# EAGLE schematic 56 ch sample-and-hold card v1.0 (EAGLE 9.6.2)

## Sheet 1 of 3
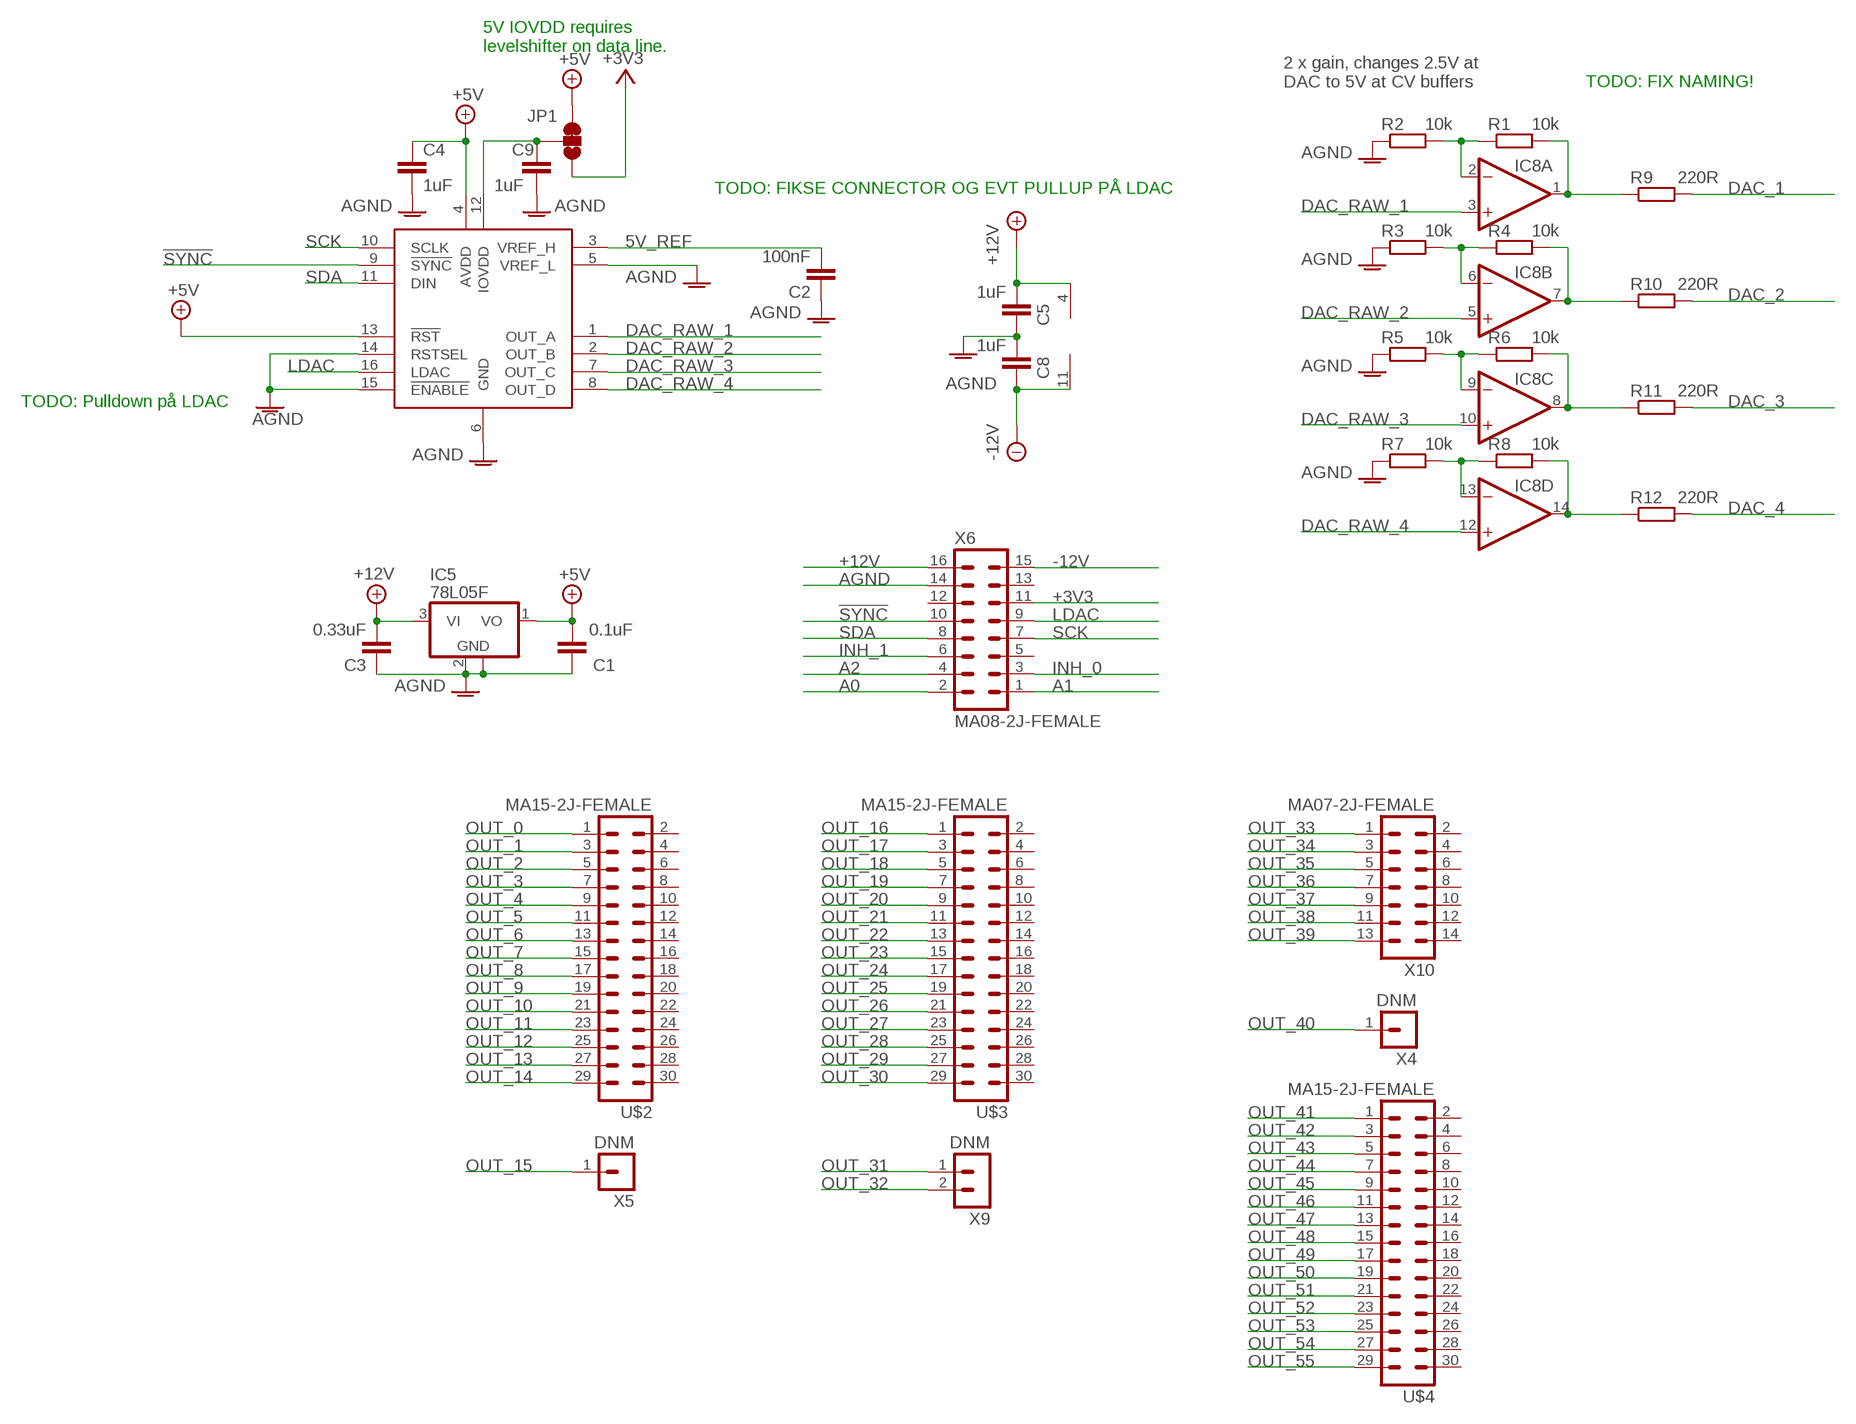
[diagram p0: schematic, sheet 1]

### Parts
C1  0.1uF  C-EUC0603  [C0603]
C2  100nF  C-EUC0603  [C0603]
C3  0.33uF  C-EUC0603  [C0603]
C4  1uF  C-EU-J0402  [C0402-J]
C5  1uF  C-EU-J0402  [C0402-J]
C8  1uF  C-EU-J0402  [C0402-J]
C9  1uF  C-EU-J0402  [C0402-J]
IC2  DAC8565F  [DIL16-FM-CON]
IC5  78L05F  [SOT89]
IC8  TL074JT  [TSSOP14J]
JP1  JUMPER-SMT_3_1-NC_TRACE_NO-SILK_DNM  JUMPER-SMT_3_1-NC_TRACE_NO-SILK  [SMT-JUMPER_3_1-NC_TRACE_NO-SILK]
R1  10k  R-EU_R0603  [R0603]
R2  10k  R-EU_R0603  [R0603]
R3  10k  R-EU_R0603  [R0603]
R4  10k  R-EU_R0603  [R0603]
R5  10k  R-EU_R0603  [R0603]
R6  10k  R-EU_R0603  [R0603]
R7  10k  R-EU_R0603  [R0603]
R8  10k  R-EU_R0603  [R0603]
R9  220R  R-EU_R0603  [R0603]
R10  220R  R-EU_R0603  [R0603]
R11  220R  R-EU_R0603  [R0603]
R12  220R  R-EU_R0603  [R0603]
U$2  MA15-2J-FEMALE  MA15-2J  [MA15-2J]
U$3  MA15-2J-FEMALE  MA15-2J  [MA15-2J]
U$4  MA15-2J-FEMALE  MA15-2J  [MA15-2J]
X4  DNM  MA01-1JN  [MA01N-1J]
X5  DNM  MA01-1JN  [MA01N-1J]
X6  MA08-2J-FEMALE  MA08-2J  [MA08-2J]
X9  DNM  MA02-1JN  [MA02N-1J]
X10  MA07-2J-FEMALE  MA07-2J  [MA07-2J]

### Nets
5V_REF: C2.2 IC2.3(VREF_H)
!SYNC: IC2.9(!SYNC) X6.10
+3V3: JP1.1 X6.11
+5V: C1.2 C4.1 IC2.4(AVDD) IC2.13(!RST) IC5.1(VO) JP1.3 ; also sheet 2,3
+12V: C3.2 C5.1 IC5.3(VI) IC8.4(P:V+) X6.16 ; also sheet 2,3
-12V: C8.2 IC8.11(P:V-) X6.15 ; also sheet 2,3
A0: X6.2 ; also sheet 2,3
A1: X6.1 ; also sheet 2,3
A2: X6.4 ; also sheet 2,3
AGND: C1.1 C2.1 C3.1 C4.2 C5.2 C8.1 C9.2 IC2.5(VREF_L) IC2.6(GND) IC2.14(RSTSEL) IC2.15(!ENABLE) IC5.2(GND) IC5.2@1(GND) R2.1 R3.1 R5.1 R7.1 X6.14 ; also sheet 2,3
DAC_1: R9.2 ; also sheet 3
DAC_2: R10.2 ; also sheet 3
DAC_3: R11.2 ; also sheet 2
DAC_4: R12.2 ; also sheet 2
DAC_BUF_1: IC8.1(A:OUT) R1.2 R9.1
DAC_BUF_2: IC8.7(B:OUT) R4.2 R10.1
DAC_BUF_3: IC8.8(C:OUT) R6.2 R11.1
DAC_BUF_4: IC8.14(D:OUT) R8.2 R12.1
DAC_RAW_1: IC2.1(OUT_A) IC8.3(A:+IN)
DAC_RAW_2: IC2.2(OUT_B) IC8.5(B:+IN)
DAC_RAW_3: IC2.7(OUT_C) IC8.10(C:+IN)
DAC_RAW_4: IC2.8(OUT_D) IC8.12(D:+IN)
INH_0: X6.3 ; also sheet 2,3
INH_1: X6.6 ; also sheet 2,3
LDAC: IC2.16(LDAC) X6.9
N$1: C9.1 IC2.12(IOVDD) JP1.2
N$2: IC8.2(A:-IN) R1.1 R2.2
N$3: IC8.6(B:-IN) R3.2 R4.1
N$4: IC8.9(C:-IN) R5.2 R6.1
N$5: IC8.13(D:-IN) R7.2 R8.1
OUT_0: U$2.1 ; also sheet 2
OUT_1: U$2.3 ; also sheet 2
OUT_2: U$2.5 ; also sheet 2
OUT_3: U$2.7 ; also sheet 2
OUT_4: U$2.9 ; also sheet 2
OUT_5: U$2.11 ; also sheet 2
OUT_6: U$2.13 ; also sheet 2
OUT_7: U$2.15 ; also sheet 2
OUT_8: U$2.17 ; also sheet 2
OUT_9: U$2.19 ; also sheet 2
OUT_10: U$2.21 ; also sheet 2
OUT_11: U$2.23 ; also sheet 2
OUT_12: U$2.25 ; also sheet 2
OUT_13: U$2.27 ; also sheet 2
OUT_14: U$2.29 ; also sheet 2
OUT_15: X5.1 ; also sheet 2
OUT_16: U$3.1 ; also sheet 2
OUT_17: U$3.3 ; also sheet 2
OUT_18: U$3.5 ; also sheet 2
OUT_19: U$3.7 ; also sheet 2
OUT_20: U$3.9 ; also sheet 2
OUT_21: U$3.11 ; also sheet 2
OUT_22: U$3.13 ; also sheet 2
OUT_23: U$3.15 ; also sheet 2
OUT_24: U$3.17 ; also sheet 2
OUT_25: U$3.19 ; also sheet 2
OUT_26: U$3.21 ; also sheet 2
OUT_27: U$3.23 ; also sheet 2
OUT_28: U$3.25 ; also sheet 2
OUT_29: U$3.27 ; also sheet 2
OUT_30: U$3.29 ; also sheet 2
OUT_31: X9.1 ; also sheet 2
OUT_32: X9.2 ; also sheet 3
OUT_33: X10.1 ; also sheet 3
OUT_34: X10.3 ; also sheet 3
OUT_35: X10.5 ; also sheet 3
OUT_36: X10.7 ; also sheet 3
OUT_37: X10.9 ; also sheet 3
OUT_38: X10.11 ; also sheet 3
OUT_39: X10.13 ; also sheet 3
OUT_40: X4.1 ; also sheet 3
OUT_41: U$4.1 ; also sheet 3
OUT_42: U$4.3 ; also sheet 3
OUT_43: U$4.5 ; also sheet 3
OUT_44: U$4.7 ; also sheet 3
OUT_45: U$4.9 ; also sheet 3
OUT_46: U$4.11 ; also sheet 3
OUT_47: U$4.13 ; also sheet 3
OUT_48: U$4.15 ; also sheet 3
OUT_49: U$4.17 ; also sheet 3
OUT_50: U$4.19 ; also sheet 3
OUT_51: U$4.21 ; also sheet 3
OUT_52: U$4.23 ; also sheet 3
OUT_53: U$4.25 ; also sheet 3
OUT_54: U$4.27 ; also sheet 3
OUT_55: U$4.29 ; also sheet 3
SCK: IC2.10(SCLK) X6.7
SDA: IC2.11(DIN) X6.8
Unconnected: U$2.2 U$2.4 U$2.6 U$2.8 U$2.10 U$2.12 U$2.14 U$2.16 U$2.18 U$2.20 U$2.22 U$2.24 U$2.26 U$2.28 U$2.30 U$3.2 U$3.4 U$3.6 U$3.8 U$3.10 U$3.12 U$3.14 U$3.16 U$3.18 U$3.20 U$3.22 U$3.24 U$3.26 U$3.28 U$3.30 U$4.2 U$4.4 U$4.6 U$4.8 U$4.10 U$4.12 U$4.14 U$4.16 U$4.18 U$4.20 U$4.22 U$4.24 U$4.26 U$4.28 U$4.30 X6.5 X6.12 X6.13 X10.2 X10.4 X10.6 X10.8 X10.10 X10.12 X10.14

### Notes on the sheet
- 5V IOVDD requires
  levelshifter on data line.
- 2 x gain, changes 2.5V at
  DAC to 5V at CV buffers
- TODO: FIX NAMING!
- TODO: FIKSE CONNECTOR OG EVT PULLUP PÅ LDAC
- TODO: Pulldown på LDAC

## Sheet 2 of 3
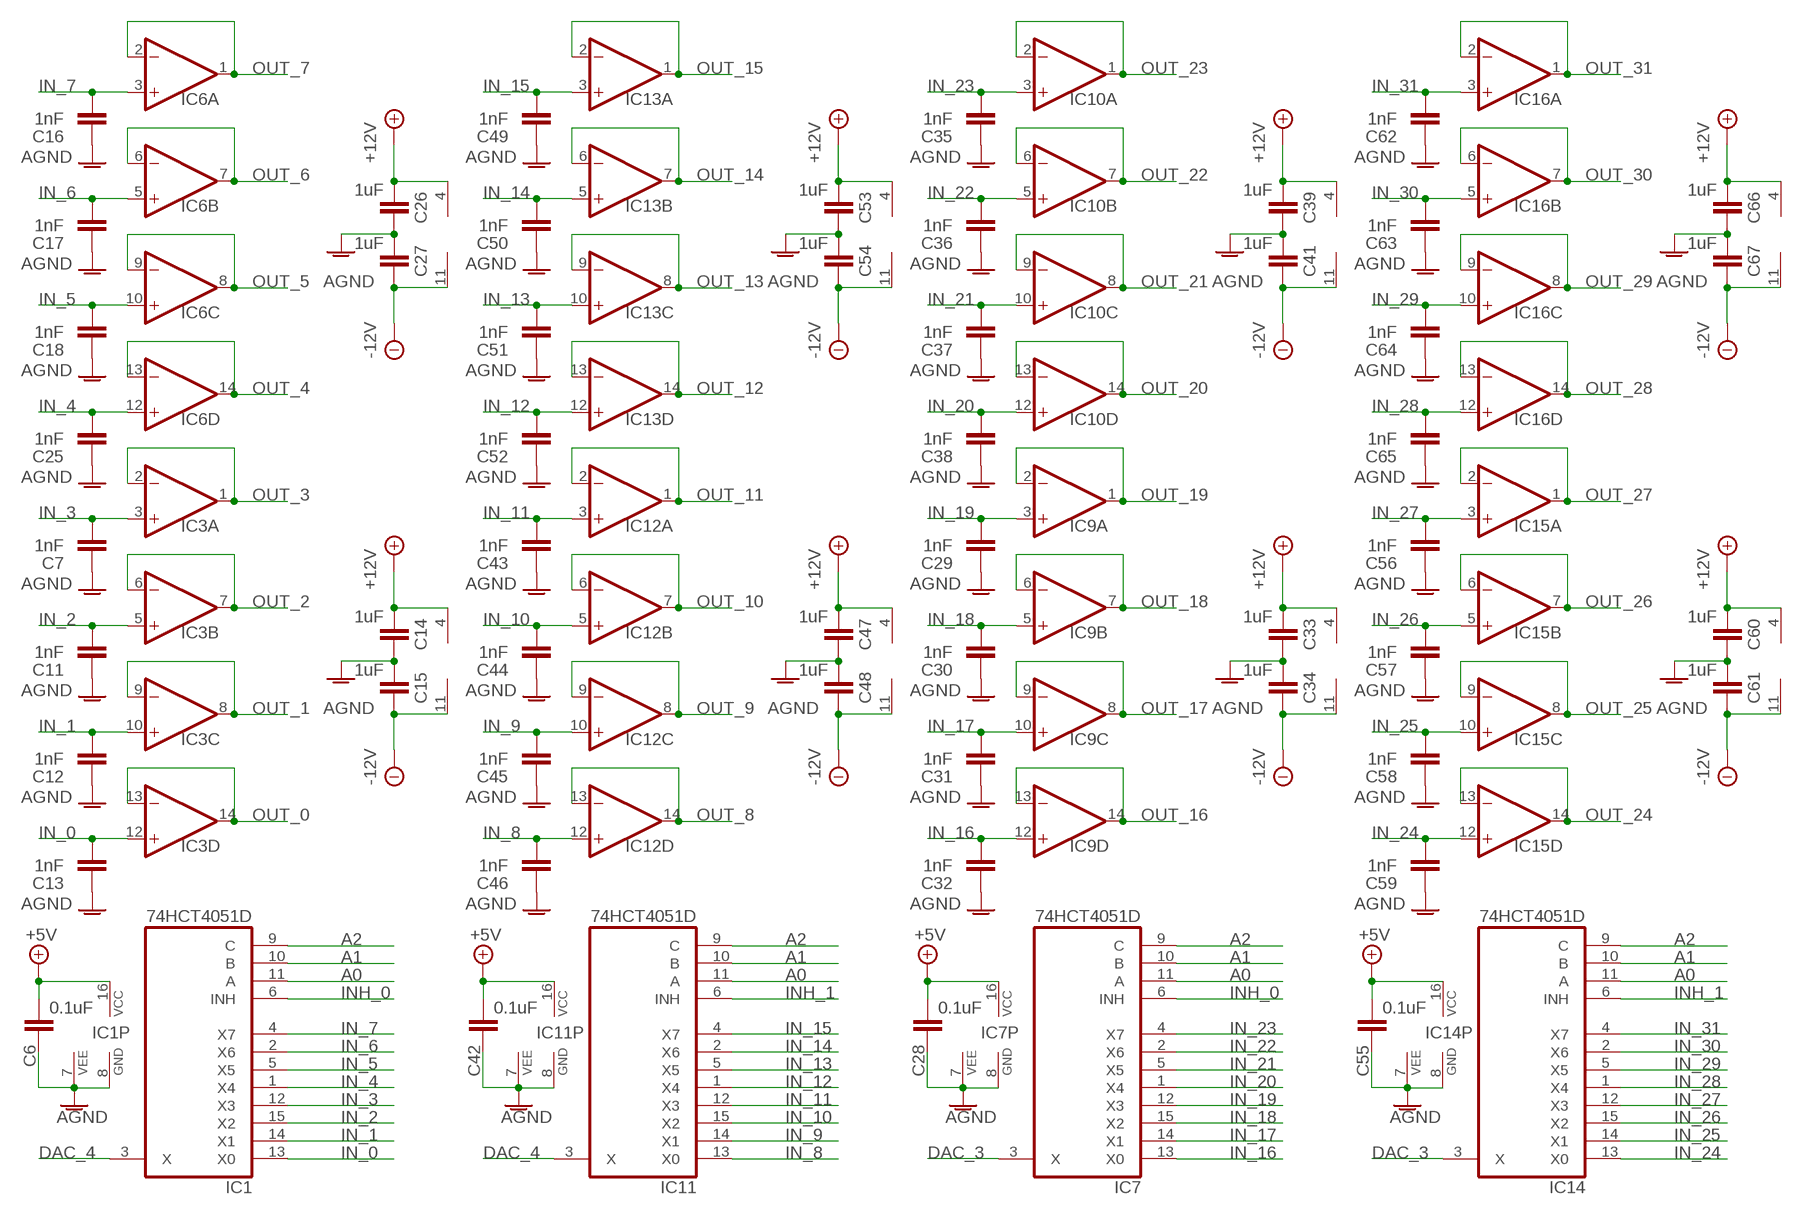
[diagram p1: schematic, sheet 2]

### Parts
C6  0.1uF  C-EU-J0402  [C0402-J]
C7  1nF  C-EU-J0603  [C0603-J]
C11  1nF  C-EU-J0603  [C0603-J]
C12  1nF  C-EU-J0603  [C0603-J]
C13  1nF  C-EU-J0603  [C0603-J]
C14  1uF  C-EU-J0402  [C0402-J]
C15  1uF  C-EU-J0402  [C0402-J]
C16  1nF  C-EU-J0603  [C0603-J]
C17  1nF  C-EU-J0603  [C0603-J]
C18  1nF  C-EU-J0603  [C0603-J]
C25  1nF  C-EU-J0603  [C0603-J]
C26  1uF  C-EU-J0402  [C0402-J]
C27  1uF  C-EU-J0402  [C0402-J]
C28  0.1uF  C-EU-J0402  [C0402-J]
C29  1nF  C-EU-J0603  [C0603-J]
C30  1nF  C-EU-J0603  [C0603-J]
C31  1nF  C-EU-J0603  [C0603-J]
C32  1nF  C-EU-J0603  [C0603-J]
C33  1uF  C-EU-J0402  [C0402-J]
C34  1uF  C-EU-J0402  [C0402-J]
C35  1nF  C-EU-J0603  [C0603-J]
C36  1nF  C-EU-J0603  [C0603-J]
C37  1nF  C-EU-J0603  [C0603-J]
C38  1nF  C-EU-J0603  [C0603-J]
C39  1uF  C-EU-J0402  [C0402-J]
C41  1uF  C-EU-J0402  [C0402-J]
C42  0.1uF  C-EU-J0402  [C0402-J]
C43  1nF  C-EU-J0603  [C0603-J]
C44  1nF  C-EU-J0603  [C0603-J]
C45  1nF  C-EU-J0603  [C0603-J]
C46  1nF  C-EU-J0603  [C0603-J]
C47  1uF  C-EU-J0402  [C0402-J]
C48  1uF  C-EU-J0402  [C0402-J]
C49  1nF  C-EU-J0603  [C0603-J]
C50  1nF  C-EU-J0603  [C0603-J]
C51  1nF  C-EU-J0603  [C0603-J]
C52  1nF  C-EU-J0603  [C0603-J]
C53  1uF  C-EU-J0402  [C0402-J]
C54  1uF  C-EU-J0402  [C0402-J]
C55  0.1uF  C-EU-J0402  [C0402-J]
C56  1nF  C-EU-J0603  [C0603-J]
C57  1nF  C-EU-J0603  [C0603-J]
C58  1nF  C-EU-J0603  [C0603-J]
C59  1nF  C-EU-J0603  [C0603-J]
C60  1uF  C-EU-J0402  [C0402-J]
C61  1uF  C-EU-J0402  [C0402-J]
C62  1nF  C-EU-J0603  [C0603-J]
C63  1nF  C-EU-J0603  [C0603-J]
C64  1nF  C-EU-J0603  [C0603-J]
C65  1nF  C-EU-J0603  [C0603-J]
C66  1uF  C-EU-J0402  [C0402-J]
C67  1uF  C-EU-J0402  [C0402-J]
IC1  74HCT4051D  4051D  [SO16]
IC3  TL074JT  [TSSOP14J]
IC6  TL074JT  [TSSOP14J]
IC7  74HCT4051D  4051D  [SO16]
IC9  TL074JT  [TSSOP14J]
IC10  TL074JT  [TSSOP14J]
IC11  74HCT4051D  4051D  [SO16]
IC12  TL074JT  [TSSOP14J]
IC13  TL074JT  [TSSOP14J]
IC14  74HCT4051D  4051D  [SO16]
IC15  TL074JT  [TSSOP14J]
IC16  TL074JT  [TSSOP14J]

### Nets
+5V: C6.2 C28.2 C42.2 C55.2 IC1.16(VCC) IC7.16(VCC) IC11.16(VCC) IC14.16(VCC) ; also sheet 1,3
+12V: C14.1 C26.1 C33.1 C39.1 C47.1 C53.1 C60.1 C66.1 IC3.4(P:V+) IC6.4(P:V+) IC9.4(P:V+) IC10.4(P:V+) IC12.4(P:V+) IC13.4(P:V+) IC15.4(P:V+) IC16.4(P:V+) ; also sheet 1,3
-12V: C15.2 C27.2 C34.2 C41.2 C48.2 C54.2 C61.2 C67.2 IC3.11(P:V-) IC6.11(P:V-) IC9.11(P:V-) IC10.11(P:V-) IC12.11(P:V-) IC13.11(P:V-) IC15.11(P:V-) IC16.11(P:V-) ; also sheet 1,3
A0: IC1.11(A) IC7.11(A) IC11.11(A) IC14.11(A) ; also sheet 1,3
A1: IC1.10(B) IC7.10(B) IC11.10(B) IC14.10(B) ; also sheet 1,3
A2: IC1.9(C) IC7.9(C) IC11.9(C) IC14.9(C) ; also sheet 1,3
AGND: C6.1 C7.1 C11.1 C12.1 C13.1 C14.2 C15.1 C16.1 C17.1 C18.1 C25.1 C26.2 C27.1 C28.1 C29.1 C30.1 C31.1 C32.1 C33.2 C34.1 C35.1 C36.1 C37.1 C38.1 C39.2 C41.1 C42.1 C43.1 C44.1 C45.1 C46.1 C47.2 C48.1 C49.1 C50.1 C51.1 C52.1 C53.2 C54.1 C55.1 C56.1 C57.1 C58.1 C59.1 C60.2 C61.1 C62.1 C63.1 C64.1 C65.1 C66.2 C67.1 IC1.7(VEE) IC1.8(GND) IC7.7(VEE) IC7.8(GND) IC11.7(VEE) IC11.8(GND) IC14.7(VEE) IC14.8(GND) ; also sheet 1,3
DAC_3: IC7.3(X) IC14.3(X) ; also sheet 1
DAC_4: IC1.3(X) IC11.3(X) ; also sheet 1
IN_0: C13.2 IC1.13(X0) IC3.12(D:+IN)
IN_1: C12.2 IC1.14(X1) IC3.10(C:+IN)
IN_2: C11.2 IC1.15(X2) IC3.5(B:+IN)
IN_3: C7.2 IC1.12(X3) IC3.3(A:+IN)
IN_4: C25.2 IC1.1(X4) IC6.12(D:+IN)
IN_5: C18.2 IC1.5(X5) IC6.10(C:+IN)
IN_6: C17.2 IC1.2(X6) IC6.5(B:+IN)
IN_7: C16.2 IC1.4(X7) IC6.3(A:+IN)
IN_8: C46.2 IC11.13(X0) IC12.12(D:+IN)
IN_9: C45.2 IC11.14(X1) IC12.10(C:+IN)
IN_10: C44.2 IC11.15(X2) IC12.5(B:+IN)
IN_11: C43.2 IC11.12(X3) IC12.3(A:+IN)
IN_12: C52.2 IC11.1(X4) IC13.12(D:+IN)
IN_13: C51.2 IC11.5(X5) IC13.10(C:+IN)
IN_14: C50.2 IC11.2(X6) IC13.5(B:+IN)
IN_15: C49.2 IC11.4(X7) IC13.3(A:+IN)
IN_16: C32.2 IC7.13(X0) IC9.12(D:+IN)
IN_17: C31.2 IC7.14(X1) IC9.10(C:+IN)
IN_18: C30.2 IC7.15(X2) IC9.5(B:+IN)
IN_19: C29.2 IC7.12(X3) IC9.3(A:+IN)
IN_20: C38.2 IC7.1(X4) IC10.12(D:+IN)
IN_21: C37.2 IC7.5(X5) IC10.10(C:+IN)
IN_22: C36.2 IC7.2(X6) IC10.5(B:+IN)
IN_23: C35.2 IC7.4(X7) IC10.3(A:+IN)
IN_24: C59.2 IC14.13(X0) IC15.12(D:+IN)
IN_25: C58.2 IC14.14(X1) IC15.10(C:+IN)
IN_26: C57.2 IC14.15(X2) IC15.5(B:+IN)
IN_27: C56.2 IC14.12(X3) IC15.3(A:+IN)
IN_28: C65.2 IC14.1(X4) IC16.12(D:+IN)
IN_29: C64.2 IC14.5(X5) IC16.10(C:+IN)
IN_30: C63.2 IC14.2(X6) IC16.5(B:+IN)
IN_31: C62.2 IC14.4(X7) IC16.3(A:+IN)
INH_0: IC1.6(INH) IC7.6(INH) ; also sheet 1,3
INH_1: IC11.6(INH) IC14.6(INH) ; also sheet 1,3
OUT_0: IC3.13(D:-IN) IC3.14(D:OUT) ; also sheet 1
OUT_1: IC3.8(C:OUT) IC3.9(C:-IN) ; also sheet 1
OUT_2: IC3.6(B:-IN) IC3.7(B:OUT) ; also sheet 1
OUT_3: IC3.1(A:OUT) IC3.2(A:-IN) ; also sheet 1
OUT_4: IC6.13(D:-IN) IC6.14(D:OUT) ; also sheet 1
OUT_5: IC6.8(C:OUT) IC6.9(C:-IN) ; also sheet 1
OUT_6: IC6.6(B:-IN) IC6.7(B:OUT) ; also sheet 1
OUT_7: IC6.1(A:OUT) IC6.2(A:-IN) ; also sheet 1
OUT_8: IC12.13(D:-IN) IC12.14(D:OUT) ; also sheet 1
OUT_9: IC12.8(C:OUT) IC12.9(C:-IN) ; also sheet 1
OUT_10: IC12.6(B:-IN) IC12.7(B:OUT) ; also sheet 1
OUT_11: IC12.1(A:OUT) IC12.2(A:-IN) ; also sheet 1
OUT_12: IC13.13(D:-IN) IC13.14(D:OUT) ; also sheet 1
OUT_13: IC13.8(C:OUT) IC13.9(C:-IN) ; also sheet 1
OUT_14: IC13.6(B:-IN) IC13.7(B:OUT) ; also sheet 1
OUT_15: IC13.1(A:OUT) IC13.2(A:-IN) ; also sheet 1
OUT_16: IC9.13(D:-IN) IC9.14(D:OUT) ; also sheet 1
OUT_17: IC9.8(C:OUT) IC9.9(C:-IN) ; also sheet 1
OUT_18: IC9.6(B:-IN) IC9.7(B:OUT) ; also sheet 1
OUT_19: IC9.1(A:OUT) IC9.2(A:-IN) ; also sheet 1
OUT_20: IC10.13(D:-IN) IC10.14(D:OUT) ; also sheet 1
OUT_21: IC10.8(C:OUT) IC10.9(C:-IN) ; also sheet 1
OUT_22: IC10.6(B:-IN) IC10.7(B:OUT) ; also sheet 1
OUT_23: IC10.1(A:OUT) IC10.2(A:-IN) ; also sheet 1
OUT_24: IC15.13(D:-IN) IC15.14(D:OUT) ; also sheet 1
OUT_25: IC15.8(C:OUT) IC15.9(C:-IN) ; also sheet 1
OUT_26: IC15.6(B:-IN) IC15.7(B:OUT) ; also sheet 1
OUT_27: IC15.1(A:OUT) IC15.2(A:-IN) ; also sheet 1
OUT_28: IC16.13(D:-IN) IC16.14(D:OUT) ; also sheet 1
OUT_29: IC16.8(C:OUT) IC16.9(C:-IN) ; also sheet 1
OUT_30: IC16.6(B:-IN) IC16.7(B:OUT) ; also sheet 1
OUT_31: IC16.1(A:OUT) IC16.2(A:-IN) ; also sheet 1

## Sheet 3 of 3
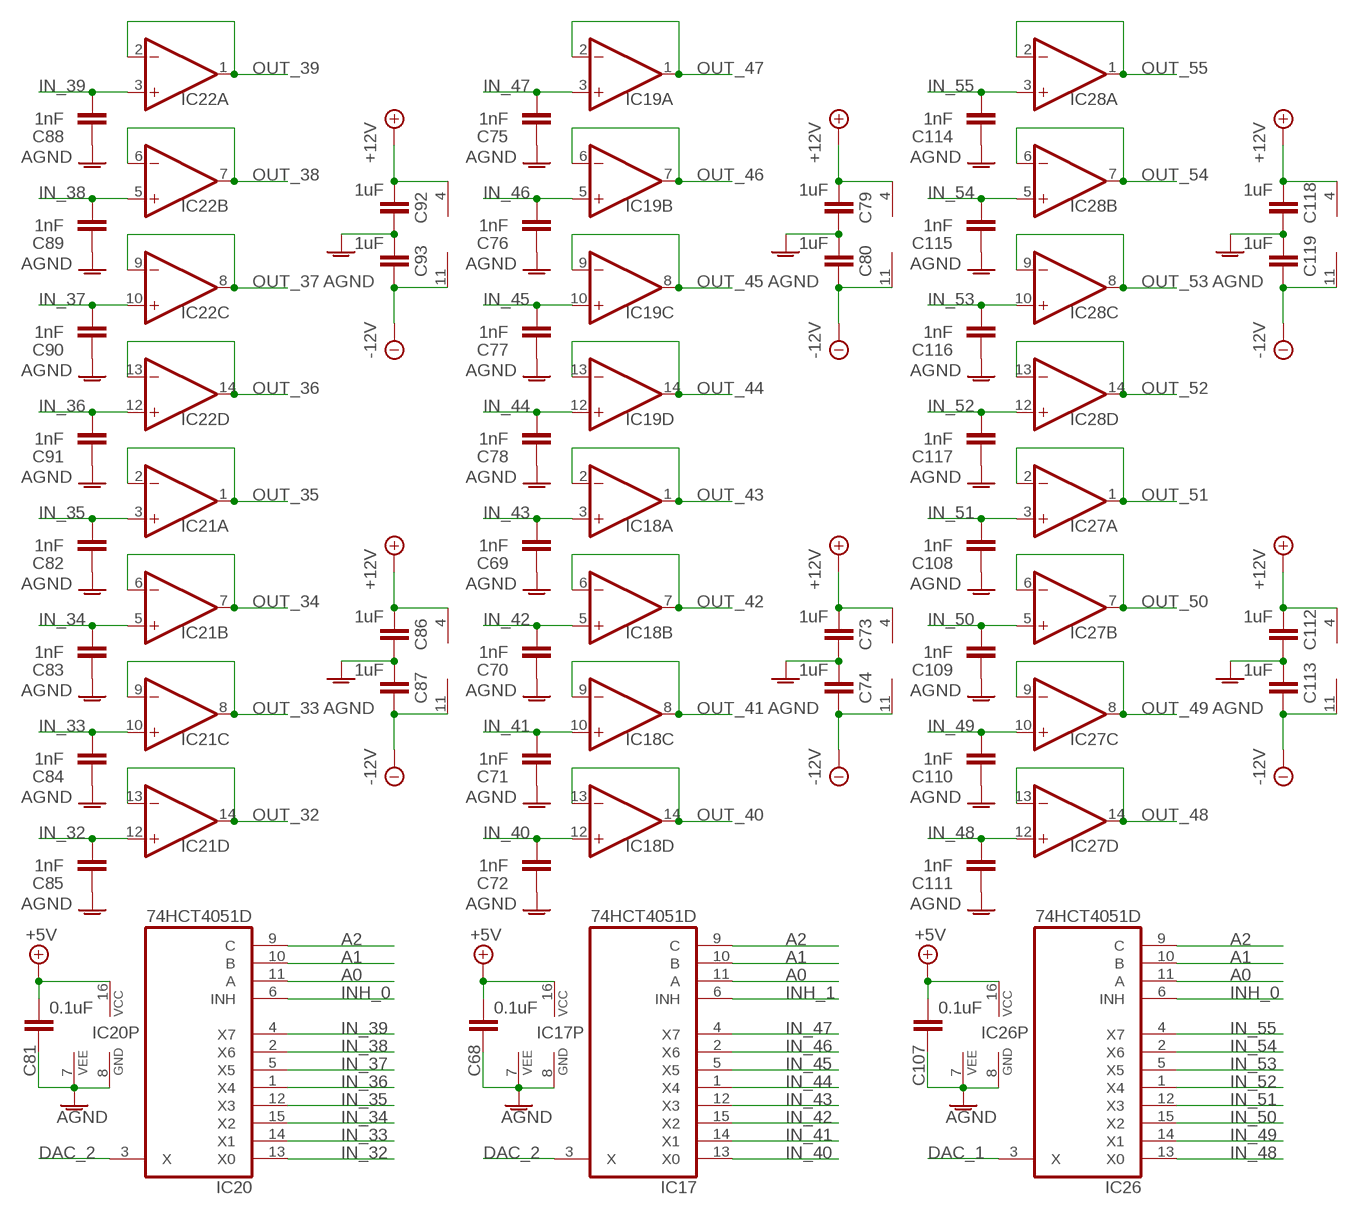
[diagram p2: schematic, sheet 3]

### Parts
C68  0.1uF  C-EU-J0402  [C0402-J]
C69  1nF  C-EU-J0603  [C0603-J]
C70  1nF  C-EU-J0603  [C0603-J]
C71  1nF  C-EU-J0603  [C0603-J]
C72  1nF  C-EU-J0603  [C0603-J]
C73  1uF  C-EU-J0402  [C0402-J]
C74  1uF  C-EU-J0402  [C0402-J]
C75  1nF  C-EU-J0603  [C0603-J]
C76  1nF  C-EU-J0603  [C0603-J]
C77  1nF  C-EU-J0603  [C0603-J]
C78  1nF  C-EU-J0603  [C0603-J]
C79  1uF  C-EU-J0402  [C0402-J]
C80  1uF  C-EU-J0402  [C0402-J]
C81  0.1uF  C-EU-J0402  [C0402-J]
C82  1nF  C-EU-J0603  [C0603-J]
C83  1nF  C-EU-J0603  [C0603-J]
C84  1nF  C-EU-J0603  [C0603-J]
C85  1nF  C-EU-J0603  [C0603-J]
C86  1uF  C-EU-J0402  [C0402-J]
C87  1uF  C-EU-J0402  [C0402-J]
C88  1nF  C-EU-J0603  [C0603-J]
C89  1nF  C-EU-J0603  [C0603-J]
C90  1nF  C-EU-J0603  [C0603-J]
C91  1nF  C-EU-J0603  [C0603-J]
C92  1uF  C-EU-J0402  [C0402-J]
C93  1uF  C-EU-J0402  [C0402-J]
C107  0.1uF  C-EU-J0402  [C0402-J]
C108  1nF  C-EU-J0603  [C0603-J]
C109  1nF  C-EU-J0603  [C0603-J]
C110  1nF  C-EU-J0603  [C0603-J]
C111  1nF  C-EU-J0603  [C0603-J]
C112  1uF  C-EU-J0402  [C0402-J]
C113  1uF  C-EU-J0402  [C0402-J]
C114  1nF  C-EU-J0603  [C0603-J]
C115  1nF  C-EU-J0603  [C0603-J]
C116  1nF  C-EU-J0603  [C0603-J]
C117  1nF  C-EU-J0603  [C0603-J]
C118  1uF  C-EU-J0402  [C0402-J]
C119  1uF  C-EU-J0402  [C0402-J]
IC17  74HCT4051D  4051D  [SO16]
IC18  TL074JT  [TSSOP14J]
IC19  TL074JT  [TSSOP14J]
IC20  74HCT4051D  4051D  [SO16]
IC21  TL074JT  [TSSOP14J]
IC22  TL074JT  [TSSOP14J]
IC26  74HCT4051D  4051D  [SO16]
IC27  TL074JT  [TSSOP14J]
IC28  TL074JT  [TSSOP14J]

### Nets
+5V: C68.2 C81.2 C107.2 IC17.16(VCC) IC20.16(VCC) IC26.16(VCC) ; also sheet 1,2
+12V: C73.1 C79.1 C86.1 C92.1 C112.1 C118.1 IC18.4(P:V+) IC19.4(P:V+) IC21.4(P:V+) IC22.4(P:V+) IC27.4(P:V+) IC28.4(P:V+) ; also sheet 1,2
-12V: C74.2 C80.2 C87.2 C93.2 C113.2 C119.2 IC18.11(P:V-) IC19.11(P:V-) IC21.11(P:V-) IC22.11(P:V-) IC27.11(P:V-) IC28.11(P:V-) ; also sheet 1,2
A0: IC17.11(A) IC20.11(A) IC26.11(A) ; also sheet 1,2
A1: IC17.10(B) IC20.10(B) IC26.10(B) ; also sheet 1,2
A2: IC17.9(C) IC20.9(C) IC26.9(C) ; also sheet 1,2
AGND: C68.1 C69.1 C70.1 C71.1 C72.1 C73.2 C74.1 C75.1 C76.1 C77.1 C78.1 C79.2 C80.1 C81.1 C82.1 C83.1 C84.1 C85.1 C86.2 C87.1 C88.1 C89.1 C90.1 C91.1 C92.2 C93.1 C107.1 C108.1 C109.1 C110.1 C111.1 C112.2 C113.1 C114.1 C115.1 C116.1 C117.1 C118.2 C119.1 IC17.7(VEE) IC17.8(GND) IC20.7(VEE) IC20.8(GND) IC26.7(VEE) IC26.8(GND) ; also sheet 1,2
DAC_1: IC26.3(X) ; also sheet 1
DAC_2: IC17.3(X) IC20.3(X) ; also sheet 1
IN_32: C85.2 IC20.13(X0) IC21.12(D:+IN)
IN_33: C84.2 IC20.14(X1) IC21.10(C:+IN)
IN_34: C83.2 IC20.15(X2) IC21.5(B:+IN)
IN_35: C82.2 IC20.12(X3) IC21.3(A:+IN)
IN_36: C91.2 IC20.1(X4) IC22.12(D:+IN)
IN_37: C90.2 IC20.5(X5) IC22.10(C:+IN)
IN_38: C89.2 IC20.2(X6) IC22.5(B:+IN)
IN_39: C88.2 IC20.4(X7) IC22.3(A:+IN)
IN_40: C72.2 IC17.13(X0) IC18.12(D:+IN)
IN_41: C71.2 IC17.14(X1) IC18.10(C:+IN)
IN_42: C70.2 IC17.15(X2) IC18.5(B:+IN)
IN_43: C69.2 IC17.12(X3) IC18.3(A:+IN)
IN_44: C78.2 IC17.1(X4) IC19.12(D:+IN)
IN_45: C77.2 IC17.5(X5) IC19.10(C:+IN)
IN_46: C76.2 IC17.2(X6) IC19.5(B:+IN)
IN_47: C75.2 IC17.4(X7) IC19.3(A:+IN)
IN_48: C111.2 IC26.13(X0) IC27.12(D:+IN)
IN_49: C110.2 IC26.14(X1) IC27.10(C:+IN)
IN_50: C109.2 IC26.15(X2) IC27.5(B:+IN)
IN_51: C108.2 IC26.12(X3) IC27.3(A:+IN)
IN_52: C117.2 IC26.1(X4) IC28.12(D:+IN)
IN_53: C116.2 IC26.5(X5) IC28.10(C:+IN)
IN_54: C115.2 IC26.2(X6) IC28.5(B:+IN)
IN_55: C114.2 IC26.4(X7) IC28.3(A:+IN)
INH_0: IC20.6(INH) IC26.6(INH) ; also sheet 1,2
INH_1: IC17.6(INH) ; also sheet 1,2
OUT_32: IC21.13(D:-IN) IC21.14(D:OUT) ; also sheet 1
OUT_33: IC21.8(C:OUT) IC21.9(C:-IN) ; also sheet 1
OUT_34: IC21.6(B:-IN) IC21.7(B:OUT) ; also sheet 1
OUT_35: IC21.1(A:OUT) IC21.2(A:-IN) ; also sheet 1
OUT_36: IC22.13(D:-IN) IC22.14(D:OUT) ; also sheet 1
OUT_37: IC22.8(C:OUT) IC22.9(C:-IN) ; also sheet 1
OUT_38: IC22.6(B:-IN) IC22.7(B:OUT) ; also sheet 1
OUT_39: IC22.1(A:OUT) IC22.2(A:-IN) ; also sheet 1
OUT_40: IC18.13(D:-IN) IC18.14(D:OUT) ; also sheet 1
OUT_41: IC18.8(C:OUT) IC18.9(C:-IN) ; also sheet 1
OUT_42: IC18.6(B:-IN) IC18.7(B:OUT) ; also sheet 1
OUT_43: IC18.1(A:OUT) IC18.2(A:-IN) ; also sheet 1
OUT_44: IC19.13(D:-IN) IC19.14(D:OUT) ; also sheet 1
OUT_45: IC19.8(C:OUT) IC19.9(C:-IN) ; also sheet 1
OUT_46: IC19.6(B:-IN) IC19.7(B:OUT) ; also sheet 1
OUT_47: IC19.1(A:OUT) IC19.2(A:-IN) ; also sheet 1
OUT_48: IC27.13(D:-IN) IC27.14(D:OUT) ; also sheet 1
OUT_49: IC27.8(C:OUT) IC27.9(C:-IN) ; also sheet 1
OUT_50: IC27.6(B:-IN) IC27.7(B:OUT) ; also sheet 1
OUT_51: IC27.1(A:OUT) IC27.2(A:-IN) ; also sheet 1
OUT_52: IC28.13(D:-IN) IC28.14(D:OUT) ; also sheet 1
OUT_53: IC28.8(C:OUT) IC28.9(C:-IN) ; also sheet 1
OUT_54: IC28.6(B:-IN) IC28.7(B:OUT) ; also sheet 1
OUT_55: IC28.1(A:OUT) IC28.2(A:-IN) ; also sheet 1

## Library data of the parts
C1-C3 = resistor:C-EU: CAPACITOR, European symbol
C4-C9 C11-C18 C25-C39 C41-C93 C107-C119 = joakim:C-EU-J: CAPACITOR, European symbol
IC1 IC7 IC11 IC14 IC17 IC20 IC26 = 40xx:4051: 8-channel ANALOG MULTIPLEXER
IC2 = joakim:DAC8565: Texas Instruments DAC8565 4 channel 16 bit DAC, SPI 50MHz SPI @ 5v 25MHz SPI @ 3.3v Connect AVdd to IOVdd
IC3 IC6 IC8-IC10 IC12 IC13 IC15 IC16 IC18 IC19 IC21 IC22 IC27 IC28 = joakim:TL074J: OP AMP
IC5 = linear:78L*: POSITOIV-VOLTAGE REGULATORS Output up to 100 mA Source: Datasheet <http://focus.ti.com/lit/ds/symlink/ua78l05.pdf>
JP1 = SparkFun-Jumpers:JUMPER-SMT_3_1-NC_TRACE: Normally closed trace jumper (1 of 2 connections) This jumper has a trace between two pads so it's normally closed (NC). The other connection is normally open (NO). Use a razor knife to open the connection. For best results follow the IPC guidelines for cutting traces: Cutout at least 0.063 mm (0.005 in). Remove all loose material to clean up the cut area. Seal the cut with an approved epoxy. Reapply solder to reclose the connection, or to close the NO connection.
R1-R12 = rcl:R-EU_: RESISTOR, European symbol; SPICEPREFIX: R
U$2-U$4 = joakim:MA15-2J
X4 X5 = joakim:MA01-1J: PIN HEADER
X6 = joakim:MA08-2J: PIN HEADER; OC_FARNELL: unknown; OC_NEWARK: unknown
X9 = joakim:MA02-1J
X10 = joakim:MA07-2J: PIN HEADER; OC_FARNELL: unknown; OC_NEWARK: unknown